# EAGLE design coba (EAGLE 9.6.1)
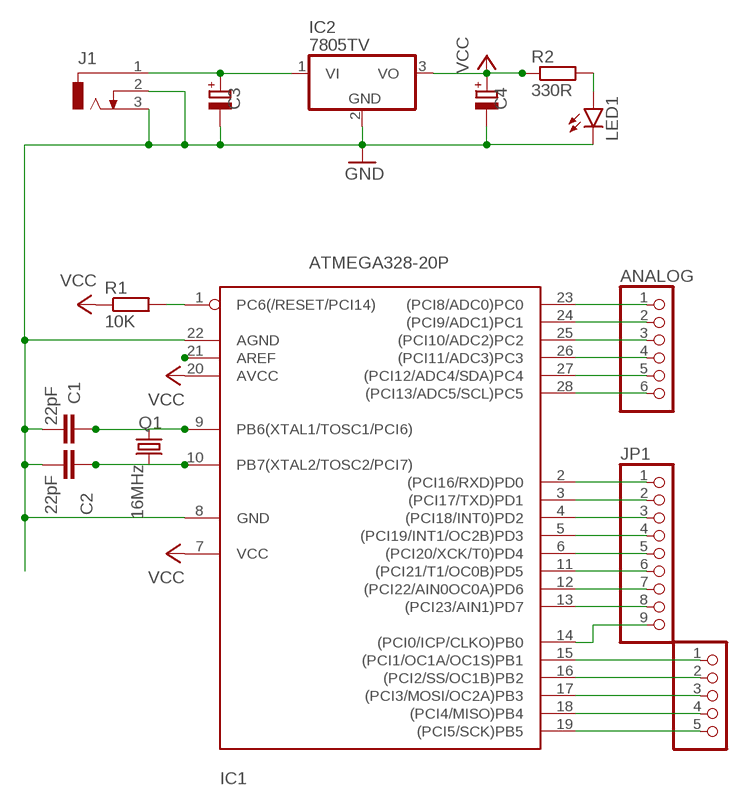
[diagram p0: schematic, sheet 1]

## Parts
ANALOG  PINHD-1X6  [1X06]
C1  22pF  C-EU025-024X044  [C025-024X044]
C2  22pF  C-EU025-024X044  [C025-024X044]
C3  CPOL-EUE2.5-6  [E2,5-6]
C4  CPOL-EUE2.5-6  [E2,5-6]
DIGITAL2  PINHD-1X5  [1X05]
IC1  ATMEGA328-20P  [DIL28-3]
IC2  7805TV  [TO220V]
J1  DCJ0303  [DCJ0303]
JP1  PINHD-1X9  [1X09]
LED1  LED3MM  [LED3MM]
Q1  16MHz  CRYSTALHC49U70  [HC49U70]
R1  10K  R-EU_0207/10  [0207/10]
R2  330R  R-EU_0207/10  [0207/10]

## Nets
ANALOG: ANALOG.2 IC1.24((PCI9/ADC1)PC1)
GND: C1.2 C2.2 C3.- C4.- IC1.8(GND) IC1.22(AGND) IC2.2(GND) J1.2 J1.3 LED1.K(C)
N$1: IC1.1(PC6(/RESET/PCI14)) R1.2
N$2: C1.1 IC1.9(PB6(XTAL1/TOSC1/PCI6)) Q1.1
N$3: C2.1 IC1.10(PB7(XTAL2/TOSC2/PCI7)) Q1.2
N$5: ANALOG.1 IC1.23((PCI8/ADC0)PC0)
N$6: C3.+ IC2.1(VI) J1.1
N$7: ANALOG.3 IC1.25((PCI10/ADC2)PC2)
N$8: ANALOG.4 IC1.26((PCI11/ADC3)PC3)
N$9: ANALOG.5 IC1.27((PCI12/ADC4/SDA)PC4)
N$10: ANALOG.6 IC1.28((PCI13/ADC5/SCL)PC5)
N$11: IC1.2((PCI16/RXD)PD0) JP1.1
N$12: IC1.3((PCI17/TXD)PD1) JP1.2
N$13: IC1.4((PCI18/INT0)PD2) JP1.3
N$14: IC1.5((PCI19/INT1/OC2B)PD3) JP1.4
N$15: IC1.6((PCI20/XCK/T0)PD4) JP1.5
N$16: IC1.11((PCI21/T1/OC0B)PD5) JP1.6
N$17: IC1.12((PCI22/AIN0OC0A)PD6) JP1.7
N$18: IC1.13((PCI23/AIN1)PD7) JP1.8
N$19: DIGITAL2.1 IC1.15((PCI1/OC1A/OC1S)PB1)
N$20: DIGITAL2.2 IC1.16((PCI2/SS/OC1B)PB2)
N$21: DIGITAL2.3 IC1.17((PCI3/MOSI/OC2A)PB3)
N$22: DIGITAL2.4 IC1.18((PCI4/MISO)PB4)
N$23: DIGITAL2.5 IC1.19((PCI5/SCK)PB5)
N$24: IC1.14((PCI0/ICP/CLKO)PB0) JP1.9
N$25: LED1.A R2.2
VCC: C4.+ IC1.7(VCC) IC1.20(AVCC) IC1.21(AREF) IC2.3(VO) R1.1 R2.1

## Library data of the parts
ANALOG = pinhead:PINHD-1X6: PIN HEADER
C1 C2 = rcl:C-EU: CAPACITOR, European symbol; SPICEPREFIX: C
C3 C4 = rcl:CPOL-EU: POLARIZED CAPACITOR, European symbol; SPICEPREFIX: C
DIGITAL2 = pinhead:PINHD-1X5: PIN HEADER
IC1 = atmega328:ATMEGA328*P: MICROCONTROLLER 32 kBytes FLASH 2 kBytes SRAM 1 kBytes EEPROM USART 8-channel 10 bit ADC
IC2 = linear:78*: Positive VOLTAGE REGULATOR Source: http://cache.national.com/ds/LM/LM78L05.pdf http://www.fairchildsemi.com/ds/LM/LM7805.pdf
J1 = con-jack:DCJ0303: DC POWER JACK Source: DCJ0303.pdf; OC_FARNELL: unknown; OC_NEWARK: unknown
JP1 = pinhead:PINHD-1X9: PIN HEADER
LED1 = led:LED: LED OSRAM: - CHIPLED LG R971, LG N971, LY N971, LG Q971, LY Q971, LO R971, LY R971 LH N974, LH R974 LS Q976, LO Q976, LY Q976 LO Q996 - Hyper CHIPLED LW Q18S LB Q993, LB Q99A, LB R99A - SideLED LS A670, LO A670, LY A670, LG A670, LP A670 LB A673, LV A673, LT A673, LW A673 LH A674 LY A675 LS A676, LA A676, LO A676, LY A676, LW A676 LS A679, LY A679, LG A679 - Hyper Micro SIDELED® LS Y876, LA Y876, LO Y876, LY Y876 LT Y87S - SmartLED LW L88C, LW L88S LB L89C, LB L89S, LG L890 LS L89K, LO L89K, LY L89K LS L896, LA L896, LO L896, LY L896 - TOPLED LS T670, LO T670, LY T670, LG T670, LP T670 LSG T670, LSP T670, LSY T670, LOP T670, LYG T670 LG T671, LOG T671, LSG T671 LB T673, LV T673, LT T673, LW T673 LH T674 LS T676, LA T676, LO T676, LY T676, LB T676, LH T676, LSB T676, LW T676 LB T67C, LV T67C, LT T67C, LS T67K, LO T67K, LY T67K, LW E67C LS E67B, LA E67B, LO E67B, LY E67B, LB E67C, LV E67C, LT E67C LW T67C LS T679, LY T679, LG T679 LS T770, LO T770, LY T770, LG T770, LP T770 LB T773, LV T773, LT T773, LW T773 LH T774 LS E675, LA E675, LY E675, LS T675 LS T776, LA T776, LO T776, LY T776, LB T776 LHGB T686 LT T68C, LB T68C - Hyper Mini TOPLED® LB M676 - Mini TOPLED Santana® LG M470 LS M47K, LO M47K, LY M47K Source: http://www.osram.convergy.de LUXEON: - LUMILED® LXK2-PW12-R00, LXK2-PW12-S00, LXK2-PW14-U00, LXK2-PW14-V00 LXK2-PM12-R00, LXK2-PM12-S00, LXK2-PM14-U00 LXK2-PE12-Q00, LXK2-PE12-R00, LXK2-PE12-S00, LXK2-PE14-T00, LXK2-PE14-U00 LXK2-PB12-K00, LXK2-PB12-L00, LXK2-PB12-M00, LXK2-PB14-N00, LXK2-PB14-P00, LXK2-PB14-Q00 LXK2-PR12-L00, LXK2-PR12-M00, LXK2-PR14-Q00, LXK2-PR14-R00 LXK2-PD12-Q00, LXK2-PD12-R00, LXK2-PD12-S00 LXK2-PH12-R00, LXK2-PH12-S00 LXK2-PL12-P00, LXK2-PL12-Q00, LXK2-PL12-R00 Source: www.luxeon.com KINGBRIGHT: KA-3528ASYC Source: www.kingbright.com
Q1 = crystal:CRYSTAL: CRYSTAL; OC_FARNELL: unknown; OC_NEWARK: unknown
R1 R2 = resistor:R-EU_: RESISTOR, European symbol

## Board
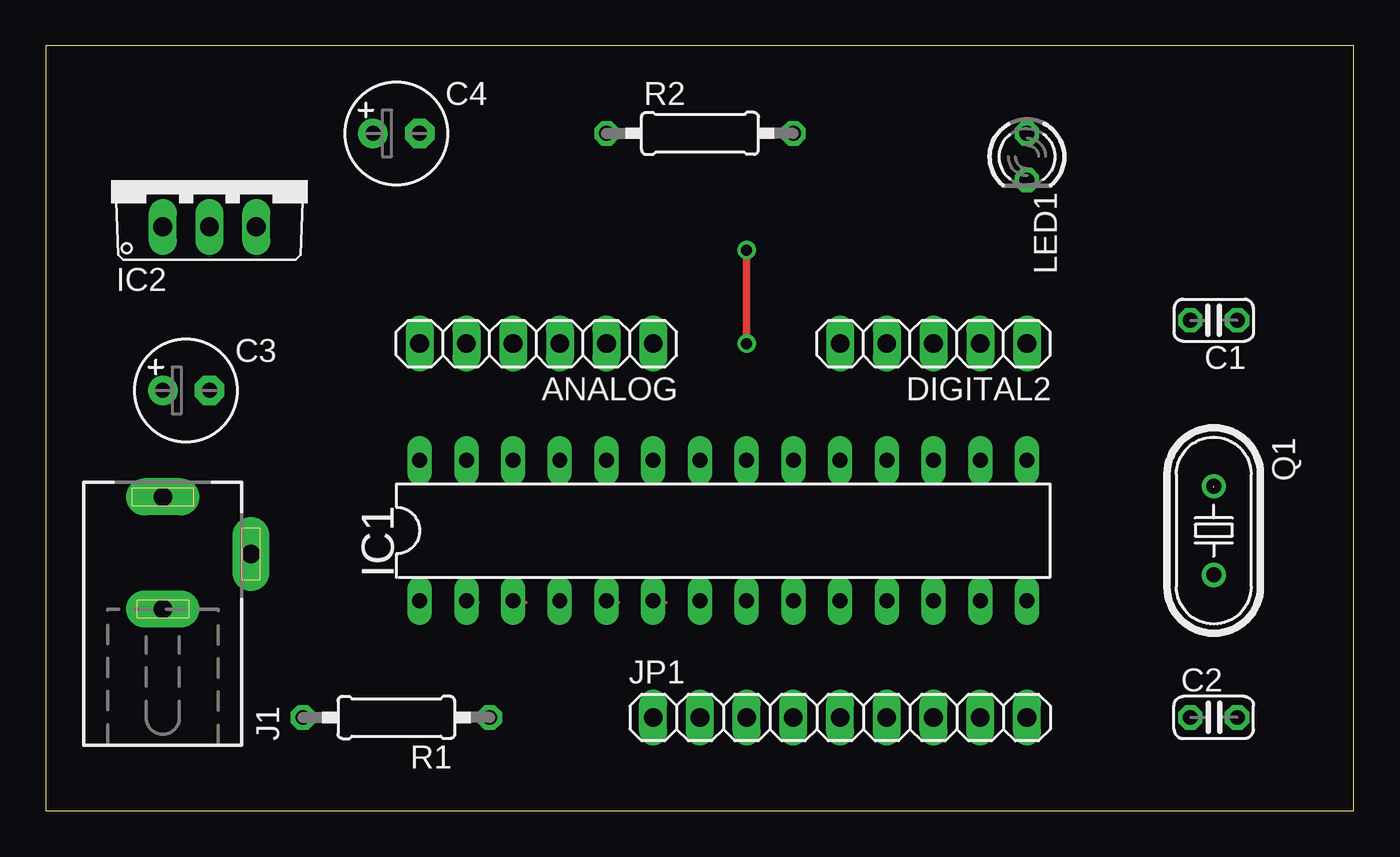
[diagram p1: board, top side]
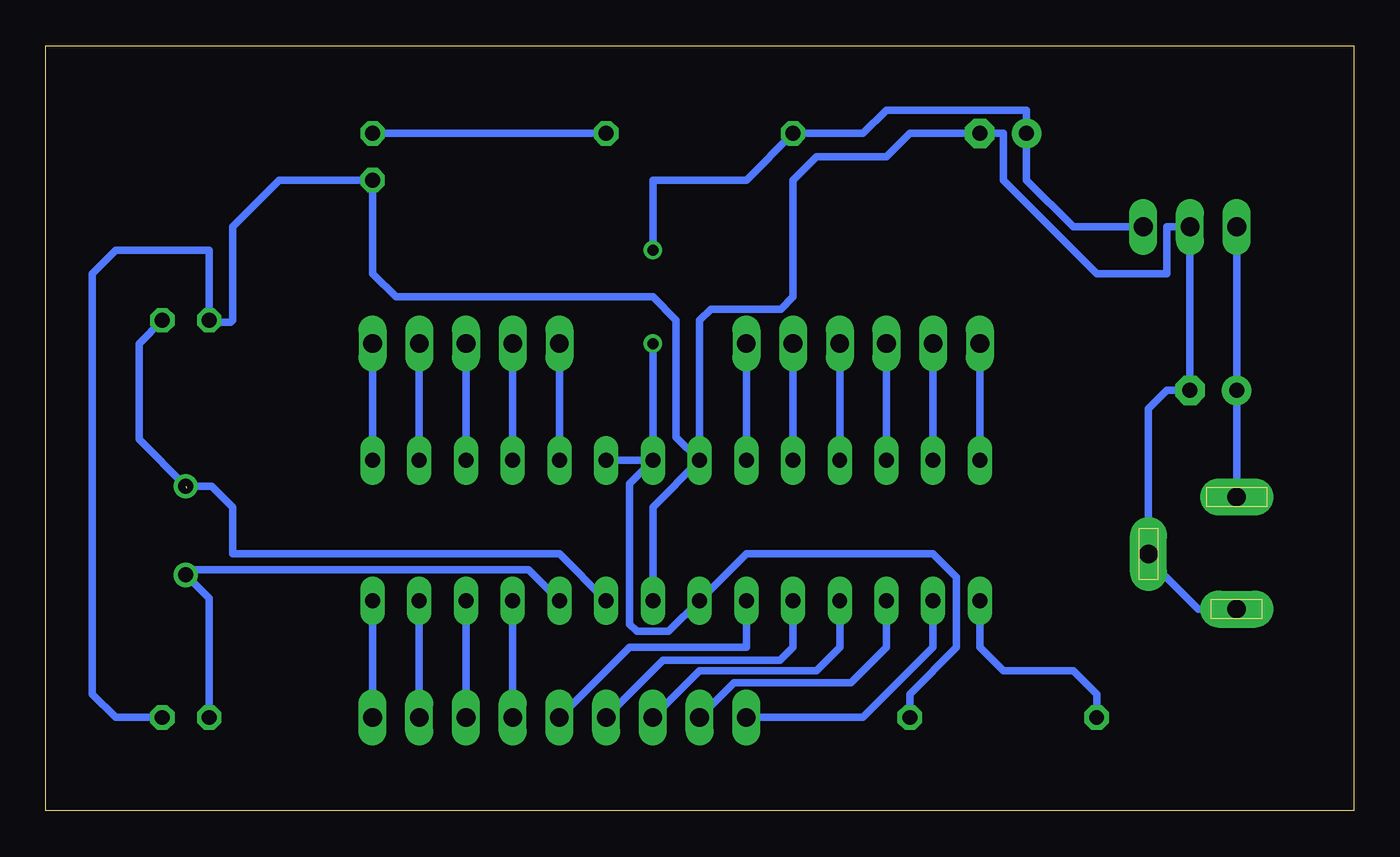
[diagram p2: board, bottom side, seen from below]

Size 71.1 x 41.58 mm. Coordinates in mm from the lower left corner, seen from the top.
Outline: 0,0 71.1,0 71.1,41.58 0,41.58 0,0
Copper layers (1*16): Top 0.035mm / dielectric 1.5mm / Bottom 0.035mm
Design rules "default": minimum track width 6mil, minimum drill 0.35mm, track to track 6mil, track to pad 6mil, pad to pad 6mil, via to via 6mil, smd to smd 6mil, copper to edge 40mil, drill to drill 6mil, minimum pad ring 10mil, minimum via ring 8mil, stop-mask expansion 4mil, vias tented up to drill 0mil, thermal gap 10mil

### Footprints (pad centres in the part's own frame; a part is rotated, then mirrored left to right if it is on the bottom)
1X06 = drill 1.016 long: 1 -6.35,0; 2 -3.81,0; 3 -1.27,0; 4 1.27,0; 5 3.81,0; 6 6.35,0
C025-024X044 = drill 0.813 octagon: 1 -1.27,0; 2 1.27,0
E2,5-6 = drill 0.813 pad 1.6: + -1.27,0 | drill 0.813 pad 1.6 octagon: - 1.27,0
1X05 = drill 1.016 long: 1 -5.08,0; 2 -2.54,0; 3 0,0; 4 2.54,0; 5 5.08,0
DIL28-3 = drill 0.813 long: 1 -16.51,-3.81; 2 -13.97,-3.81; 3 -11.43,-3.81; 4 -8.89,-3.81; 5 -6.35,-3.81; 6 -3.81,-3.81; 7 -1.27,-3.81; 8 1.27,-3.81; 9 3.81,-3.81; 10 6.35,-3.81; 11 8.89,-3.81; 12 11.43,-3.81; 13 13.97,-3.81; 14 16.51,-3.81; 15 16.51,3.81; 16 13.97,3.81; 17 11.43,3.81; 18 8.89,3.81; 19 6.35,3.81; 20 3.81,3.81; 21 1.27,3.81; 22 -1.27,3.81; 23 -3.81,3.81; 24 -6.35,3.81; 25 -8.89,3.81; 26 -11.43,3.81; 27 -13.97,3.81; 28 -16.51,3.81
TO220V = drill 1.016 long: 1 -2.54,-2.54; 2 0,-2.54; 3 2.54,-2.54
DCJ0303 = drill 1 pad 2 long: 1 0,3.1; 2 4.8,0; 3 0,-3
1X09 = drill 1.016 long: 1 -10.16,0; 2 -7.62,0; 3 -5.08,0; 4 -2.54,0; 5 0,0; 6 2.54,0; 7 5.08,0; 8 7.62,0; 9 10.16,0
LED3MM = drill 0.813 octagon: A -1.27,0; K 1.27,0
HC49U70 = drill 0.813: 1 -2.413,0; 2 2.413,0
0207/10 = drill 0.813 octagon: 1 -5.08,0; 2 5.08,0

### Placement (x,y rotation side)
ANALOG  26.67,25.4 180 top
C1  63.5,26.67 180 top
C2  63.5,5.08 0 top
C3  7.62,22.86 0 top
C4  19.05,36.83 0 top
DIGITAL2  48.26,25.4 180 top
IC1  36.83,15.24 0 top
IC2  8.89,34.29 0 top
J1  6.35,13.97 0 top
JP1  43.18,5.08 0 top
LED1  53.34,35.56 270 top
Q1  63.5,15.24 270 top
R1  19.05,5.08 180 top
R2  35.56,36.83 0 top

### Tracks (layer width: path | path; a pad name or v marks a point on that pad's centre or on a via)
ANALOG
  Top 0.152: 30.53,19.1 IC1.24 | 30.53,25.35 ANALOG.2
  Bottom 0.406: ANALOG.2 IC1.24
GND
  Top 0.152: 20.32,36.78 C4.- | 11.02,14.07 J1.2 | 8.89,22.76 C3.- | 38,11.48 IC1.8 | 35.56,18.95 IC1.22 | 62.23,26.72 C1.2 | 53.39,34.19 LED1.K
  Bottom 0.152: 64.67,5.08 C2.2 | 62.23,26.57 C1.2 | IC1.22 35.56,20.01 | 53.24,34.19 LED1.K | 20.32,36.78 C4.-
  Bottom 0.406: J1.3 8.43,10.97 11.15,13.69 J1.2 11.15,21.87 10.16,22.86 C3.- IC2.2 | IC2.2 8.89,33.02 | IC2.2 10.16,31.75 10.16,29.21 13.97,29.21 19.05,34.29 19.05,36.83 C4.- 24.13,36.83 25.4,35.56 29.21,35.56 30.48,34.29 30.48,27.94 31.14,27.28 34.95,27.28 35.56,26.67 IC1.22 | C2.2 67.31,5.08 68.58,6.35 68.58,29.21 67.31,30.48 62.23,30.48 C1.2 | 62.23,26.57 61.06,26.57 60.96,26.67 60.96,31.75 58.42,34.29 LED1.K 53.34,29.21 52.07,27.94 38.1,27.94 36.83,26.67 36.83,20.32 IC1.22 | IC1.8 38.1,16.51 IC1.22
N$1
  Top 0.152: 14.07,5.08 R1.2 | 20.32,11.33 IC1.1
  Bottom 0.406: R1.2 13.97,6.35 15.24,7.62 19.05,7.62 20.32,8.89 IC1.1
N$2  (1 unrouted)
  Top 0.152: 41.2,11.48 40.74,11.48 IC1.9 | 63.45,17.58 63.3,17.42 | 64.67,26.57 C1.1 | 63.6,17.73 Q1.1
  Bottom 0.406: C1.1 66.04,25.4 66.04,20.19 Q1.1 62.1,17.65 60.96,16.51 60.96,13.97 43.18,13.97 IC1.9
N$3
  Top 0.152: 63.45,12.7 Q1.2 | 43.79,11.48 43.18,11.48 IC1.10
  Bottom 0.406: IC1.10 44.86,13.11 63.22,13.11 Q1.2 62.23,11.56 C2.1
N$5
  Top 0.152: 33.12,19.1 IC1.23 | 33.12,25.35 ANALOG.1
  Bottom 0.406: ANALOG.1 IC1.23
N$6
  Top 0.152: 6.45,31.75 IC2.1 | 6.45,22.91 C3.+ 6.45,22.76 | 6.45,17.12 J1.1
  Bottom 0.406: IC2.1 C3.+ J1.1
N$7
  Bottom 0.406: ANALOG.3 IC1.25
N$8
  Top 0.152: 25.5,19.1 IC1.26 | 25.5,25.35 ANALOG.4
  Bottom 0.406: ANALOG.4 IC1.26
N$9
  Top 0.152: 22.91,19.1 IC1.27 | 22.91,25.35 ANALOG.5
  Bottom 0.406: ANALOG.5 IC1.27
N$10
  Bottom 0.406: IC1.28 ANALOG.6
N$11
  Top 0.152: 23.52,11.33 22.91,11.33 IC1.2
  Bottom 0.406: IC1.2 22.86,8.89 26.67,5.08 JP1.1
N$12
  Top 0.152: 26.11,11.33 25.5,11.33 IC1.3
  Bottom 0.406: IC1.3 25.4,8.89 27.33,6.96 33.68,6.96 JP1.2
N$13
  Top 0.152: 28.55,11.33 27.94,11.33 IC1.4 | 38,5.08 JP1.3
  Bottom 0.406: IC1.4 27.94,8.89 29.21,7.62 35.56,7.62 JP1.3
N$14
  Top 0.152: 31.14,11.33 30.53,11.33 IC1.5 | 40.59,5.08 JP1.4
  Bottom 0.406: IC1.5 30.48,8.89 31.19,8.18 37.54,8.18 JP1.4
N$15
  Top 0.152: 33.73,11.33 33.12,11.33 IC1.6
  Bottom 0.406: IC1.6 33.02,8.89 39.37,8.89 JP1.5
N$16
  Top 0.152: 45.77,11.33 IC1.11 | 45.77,5.08 JP1.6
  Bottom 0.406: IC1.11 JP1.6
N$17
  Top 0.152: 48.36,11.33 IC1.12 | 48.36,5.08 JP1.7
  Bottom 0.406: IC1.12 JP1.7
N$18
  Bottom 0.406: IC1.13 JP1.8
N$19
  Top 0.152: 53.39,19.1 IC1.15 | 53.39,25.35 DIGITAL2.1
  Bottom 0.406: DIGITAL2.1 IC1.15
N$20
  Bottom 0.406: DIGITAL2.2 IC1.16
N$21
  Top 0.152: 48.36,19.1 IC1.17 | 48.36,25.35 DIGITAL2.3
  Bottom 0.406: DIGITAL2.3 IC1.17
N$22
  Top 0.152: 45.77,19.1 IC1.18 | 45.77,25.35 DIGITAL2.4
  Bottom 0.406: DIGITAL2.4 IC1.18
N$23
  Bottom 0.406: DIGITAL2.5 IC1.19
N$24
  Top 0.152: 53.39,11.33 IC1.14 | 53.39,5.08 JP1.9
  Bottom 0.406: IC1.14 JP1.9
N$25
  Top 0.152: 40.74,36.93 R2.2 | 53.24,36.93 LED1.A
  Bottom 0.406: R2.2 LED1.A
VCC  (via drill 0.6)
  Top 0.152: 30.38,36.93 R2.1 30.53,36.78 | 38.15,19.1 IC1.21 38,19.1 | 40.59,19.1 IC1.20
  Top 0.406: v38.1,30.48 v38.1,25.4
  Bottom 0.152: 35.56,11.33 IC1.7 35.56,11.48 | 38,18.95 IC1.21
  Bottom 0.406: IC2.3 15.24,31.75 17.78,34.29 C4.+ 17.78,38.1 25.4,38.1 26.67,36.83 R2.1 33.02,34.29 38.1,34.29 v38.1,30.48 | IC1.21 39.37,17.78 39.37,10.16 38.96,9.75 37.24,9.75 IC1.7 33.02,13.97 22.86,13.97 21.59,12.7 21.59,8.89 24.13,6.35 R1.1 | IC1.20 IC1.21 | v38.1,25.4 IC1.21